# EAGLE design mimuz-can-v030 (EAGLE 7.7.0)
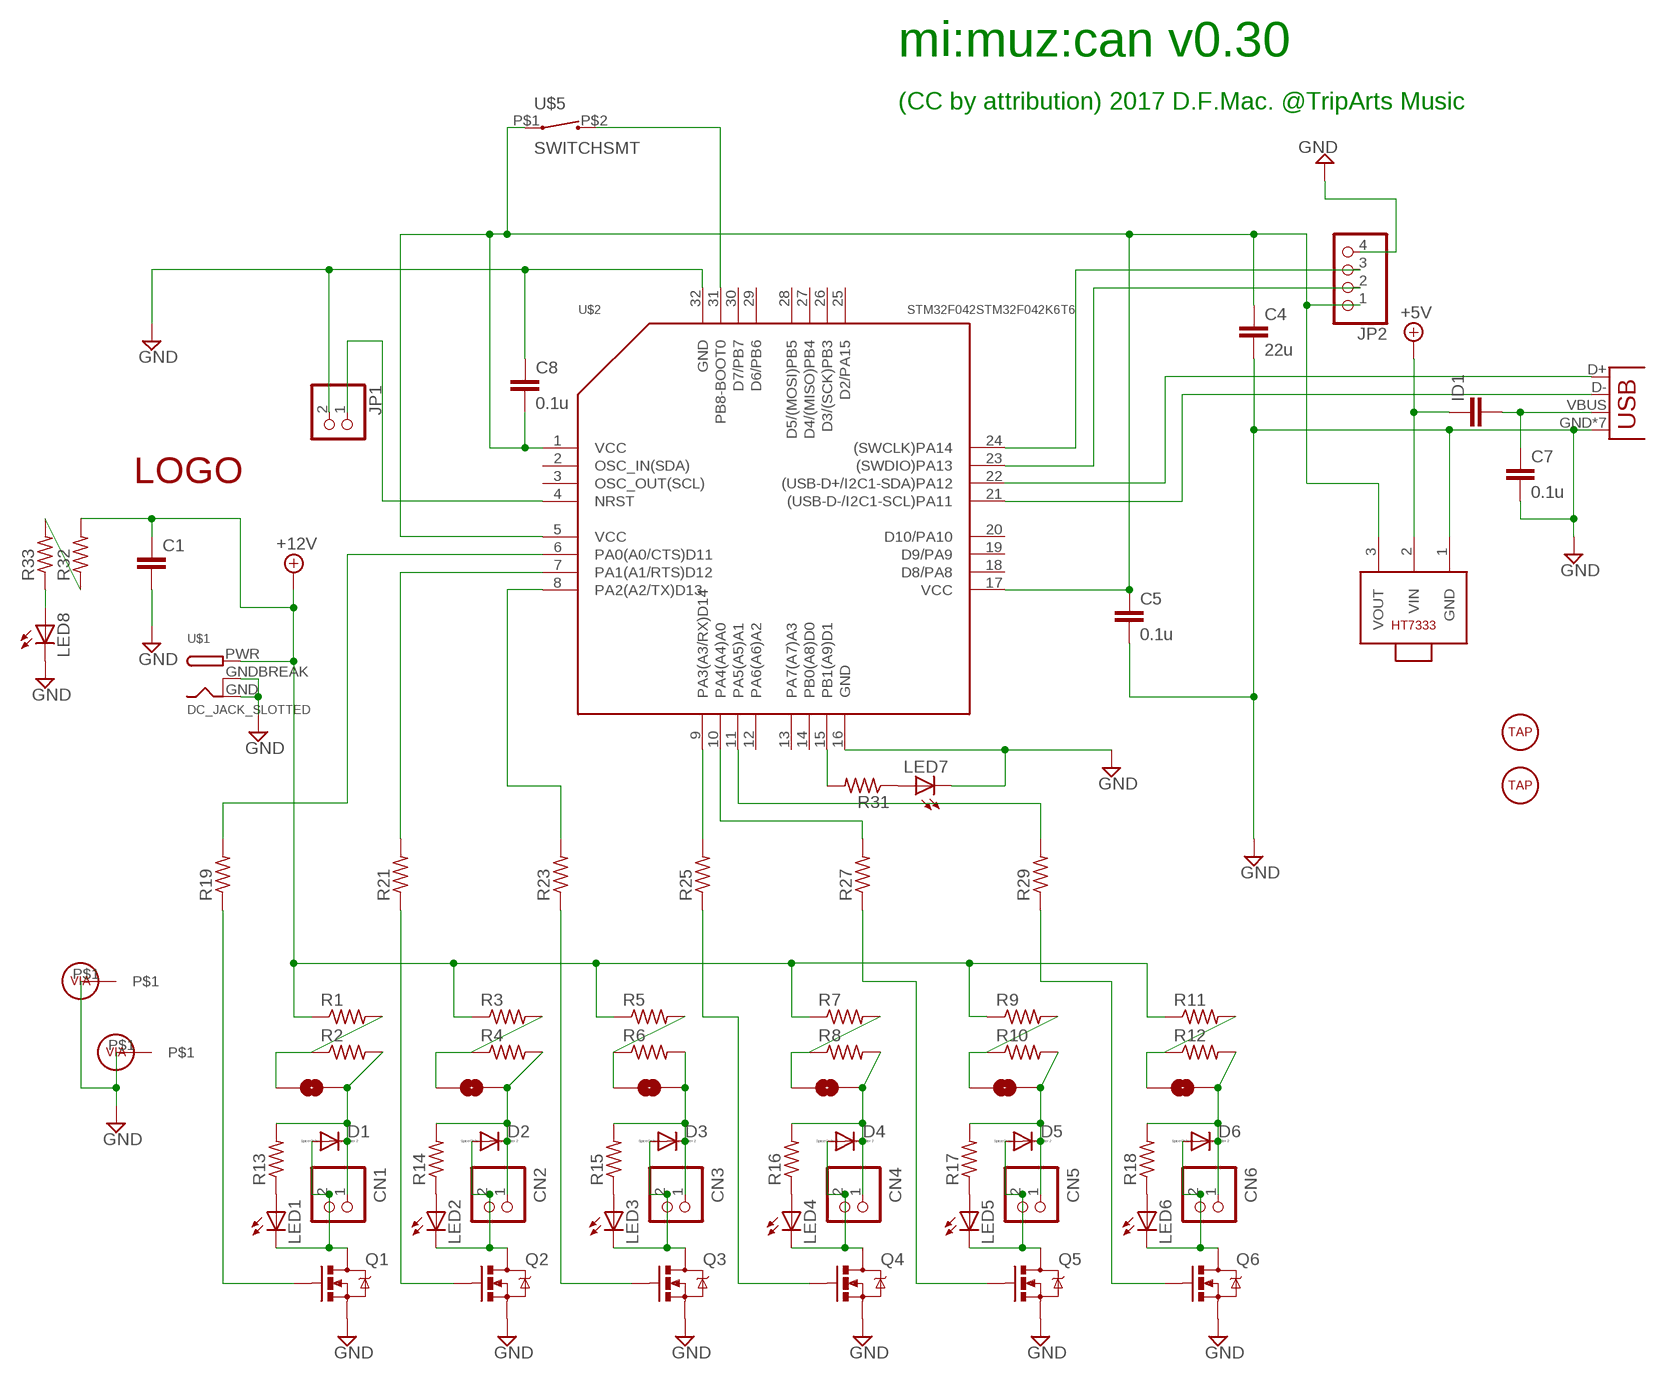
[diagram p0: schematic, sheet 1]

## Parts
C1  C-EUC1206  [C1206]
C4  22u  C-EUC0805  [C0805]
C5  0.1u  C-EUC0603  [C0603]
C7  0.1u  C-EUC0603  [C0603]
C8  0.1u  C-EUC0603  [C0603]
CN1  B2B-PH-K-S  [B2B-PH-K-S]
CN2  B2B-PH-K-S  [B2B-PH-K-S]
CN3  B2B-PH-K-S  [B2B-PH-K-S]
CN4  B2B-PH-K-S  [B2B-PH-K-S]
CN5  B2B-PH-K-S  [B2B-PH-K-S]
CN6  B2B-PH-K-S  [B2B-PH-K-S]
D1  DIODE-DO214AC  [DO214AC]
D2  DIODE-DO214AC  [DO214AC]
D3  DIODE-DO214AC  [DO214AC]
D4  DIODE-DO214AC  [DO214AC]
D5  DIODE-DO214AC  [DO214AC]
D6  DIODE-DO214AC  [DO214AC]
ID1  C-EUC0805  [C0805]
JP1  PINHD-1X2  [1X02]
JP2  PINHD-1X4  [1X04]
JP3  JUMPER-SMT_2_NO_NO-SILK  [SMT-JUMPER_2_NO_NO-SILK]
JP4  USB-MICROB  [USB-MICROB]
JP5  JUMPER-SMT_2_NO_NO-SILK  [SMT-JUMPER_2_NO_NO-SILK]
JP6  JUMPER-SMT_2_NO_NO-SILK  [SMT-JUMPER_2_NO_NO-SILK]
JP7  JUMPER-SMT_2_NO_NO-SILK  [SMT-JUMPER_2_NO_NO-SILK]
JP8  JUMPER-SMT_2_NO_NO-SILK  [SMT-JUMPER_2_NO_NO-SILK]
JP9  JUMPER-SMT_2_NO_NO-SILK  [SMT-JUMPER_2_NO_NO-SILK]
LED1  LED3MM  [LED3MM]
LED2  LED3MM  [LED3MM]
LED3  LED3MM  [LED3MM]
LED4  LED3MM  [LED3MM]
LED5  LED3MM  [LED3MM]
LED6  LED3MM  [LED3MM]
LED7  LED3MM  [LED3MM]
LED8  LED3MM  [LED3MM]
Q1  MOSFET-NCHANNELSMD  [SOT23-3]
Q2  MOSFET-NCHANNELSMD  [SOT23-3]
Q3  MOSFET-NCHANNELSMD  [SOT23-3]
Q4  MOSFET-NCHANNELSMD  [SOT23-3]
Q5  MOSFET-NCHANNELSMD  [SOT23-3]
Q6  MOSFET-NCHANNELSMD  [SOT23-3]
R1  R-US_R2512  [R2512]
R2  R-US_R2512  [R2512]
R3  R-US_R2512  [R2512]
R4  R-US_R2512  [R2512]
R5  R-US_R2512  [R2512]
R6  R-US_R2512  [R2512]
R7  R-US_R2512  [R2512]
R8  R-US_R2512  [R2512]
R9  R-US_R2512  [R2512]
R10  R-US_R2512  [R2512]
R11  R-US_R2512  [R2512]
R12  R-US_R2512  [R2512]
R13  R-US_R0805  [R0805]
R14  R-US_R0805  [R0805]
R15  R-US_R0805  [R0805]
R16  R-US_R0805  [R0805]
R17  R-US_R0805  [R0805]
R18  R-US_R0805  [R0805]
R19  R-US_R0603  [R0603]
R21  R-US_R0603  [R0603]
R23  R-US_R0603  [R0603]
R25  R-US_R0603  [R0603]
R27  R-US_R0603  [R0603]
R29  R-US_R0603  [R0603]
R31  R-US_R0603  [R0603]
R32  R-US_R0805  [R0805]
R33  R-US_R0805  [R0805]
U$1  DC_JACK_SLOTTED  [DC_JACK_SLOTTED]
U$2  STM32F042STM32F042K6T6  [TQFP32]
U$3  TAPHOLE  [TAPHOLE-3MM]
U$4  VIA  [VIA]
U$5  SWITCHSMT  [SWITCH-SMT-2*4*3]
U$6  TAPHOLE  [TAPHOLE-3MM]
U$7  VIA  [VIA]
U$12  LOGOSMALL  [LOGO-SMALL]
U$14  HT7333  [SOT89]

## Nets
3.3V: C4.1 C5.1 C8.2 JP2.1 U$2.1(VCC) U$2.5(VCC) U$2.17(VCC) U$5.P$1 U$14.3(VOUT)
+5V: ID1.1 U$14.2(VIN)
+12V: C1.1 R1.1 R3.1 R5.1 R7.1 R9.1 R11.1 R32.2 U$1.PWR
D+: JP4.D+ U$2.22((USB-D+/I2C1-SDA)PA12)
D-: JP4.D- U$2.21((USB-D-/I2C1-SCL)PA11)
GND [power]: C1.2 C4.2 C5.2 C7.2 C8.1 JP1.2 JP2.4 JP4.GND JP4.MT1(GND) JP4.MT3(GND) JP4.P$2(GND) JP4.P$4(GND) JP4.P$5(GND) JP4.P$6(GND) LED7.K(C) LED8.K(C) Q1.2(S) Q2.2(S) Q3.2(S) Q4.2(S) Q5.2(S) Q6.2(S) U$1.GND U$1.GNDBREAK U$2.16(GND) U$2.32(GND) U$4.P$1 U$7.P$1 U$14.1(GND)
N$1: JP5.1 R3.2 R4.1
N$2: JP3.1 R1.2 R2.1
N$3: JP6.1 R5.2 R6.1
N$4: CN1.1 D1.C JP3.2 R2.2 R13.2
N$5: CN2.1 D2.C JP5.2 R4.2 R14.2
N$6: CN3.1 D3.C JP6.2 R6.2 R15.2
N$7: CN1.2 D1.A LED1.K(C) Q1.3(D)
N$8: CN2.2 D2.A LED2.K(C) Q2.3(D)
N$9: CN3.2 D3.A LED3.K(C) Q3.3(D)
N$10: JP7.1 R7.2 R8.1
N$11: CN4.1 D4.C JP7.2 R8.2 R16.2
N$12: CN4.2 D4.A LED4.K(C) Q4.3(D)
N$13: CN5.2 D5.A LED5.K(C) Q5.3(D)
N$14: CN6.2 D6.A LED6.K(C) Q6.3(D)
N$15: JP8.1 R9.2 R10.1
N$16: JP9.1 R11.2 R12.1
N$17: LED1.A R13.1
N$18: CN6.1 D6.C JP9.2 R12.2 R18.2
N$19: CN5.1 D5.C JP8.2 R10.2 R17.2
N$20: LED2.A R14.1
N$21: LED3.A R15.1
N$22: LED4.A R16.1
N$23: Q2.1(G) R21.1
N$24: Q1.1(G) R19.1
N$25: LED5.A R17.1
N$26: Q3.1(G) R23.1
N$27: JP2.3 U$2.24((SWCLK)PA14)
N$28: JP2.2 U$2.23((SWDIO)PA13)
N$29: JP1.1 U$2.4(NRST)
N$30: U$2.31(PB8-BOOT0) U$5.P$2
N$31: LED6.A R18.1
N$32: R19.2 U$2.6(PA0(A0/CTS)D11)
N$33: R21.2 U$2.7(PA1(A1/RTS)D12)
N$34: R23.2 U$2.8(PA2(A2/TX)D13)
N$35: R27.2 U$2.10(PA4(A4)A0)
N$36: R25.2 U$2.9(PA3(A3/RX)D14)
N$37: Q4.1(G) R25.1
N$38: Q5.1(G) R27.1
N$39: R29.2 U$2.11(PA5(A5)A1)
N$40: Q6.1(G) R29.1
N$41: R31.2 U$2.15(PB1(A9)D1)
N$42: LED7.A R31.1
N$43: R32.1 R33.2
N$44: LED8.A R33.1
VBUS: C7.1 ID1.2 JP4.VBUS
Unconnected: U$2.2(OSC_IN(SDA)) U$2.3(OSC_OUT(SCL)) U$2.12(PA6(A6)A2) U$2.13(PA7(A7)A3) U$2.14(PB0(A8)D0) U$2.18(D8/PA8) U$2.19(D9/PA9) U$2.20(D10/PA10) U$2.25(D2/PA15) U$2.26(D3/(SCK)PB3) U$2.27(D4/(MISO)PB4) U$2.28(D5/(MOSI)PB5) U$2.29(D6/PB6) U$2.30(D7/PB7)

## Notes on the sheet
- mi:muz:can v0.30
- (CC by attribution) 2017 D.F.Mac. @TripArts Music

## Library data of the parts
C1 C4 C5 C7 C8 ID1 = 0my:C-EU: CAPACITOR, European symbol
CN1-CN6 = jst-ph:B2B-PH-*: Wire-to-Board 2.0mm pitch top mount connector Source: http://www.jst-mfg.com/product/pdf/jpn/PH.pdf http://www.jst-mfg.com/product/detail.php?series=199
D1-D6 = diode:DIODE-: DIODE
JP1 = 0my:PINHD-1X2: PIN HEADER
JP2 = 0my:PINHD-1X4: PIN HEADER
JP3 JP5-JP9 = SparkFun-Jumpers:JUMPER-SMT_2_NO: Normally open jumper This jumper has two pads in close proximity to each other. Apply solder to close the connection. Round pads are easier to solder for beginners, but are a lot larger. SparkFun Product that uses the round pads: SparkFun EL Sequencer <https://www.sparkfun.com/products/12781>
JP4 = 0my:USB: USB Connectors USB-B-PTH is fully proven SKU : PRT-00139/CONN-08278 USB-miniB is fully proven SKU : PRT-00587 USB-A-PCB is untested. USB-A-H is throughly reviewed, but untested. Spark Fun Electronics SKU : PRT-00437 USB-B-SMT is throughly reviewed, but untested. Needs silkscreen touching up. USB-A-S has not been used/tested USB-MB-H has not been used/tested USB-MICROB has been used. CONN-09505; PROD_ID: CONN-09505
LED1-LED8 = led:LED: LED OSRAM: - CHIPLED LG R971, LG N971, LY N971, LG Q971, LY Q971, LO R971, LY R971 LH N974, LH R974 LS Q976, LO Q976, LY Q976 LO Q996 - Hyper CHIPLED LW Q18S LB Q993, LB Q99A, LB R99A - SideLED LS A670, LO A670, LY A670, LG A670, LP A670 LB A673, LV A673, LT A673, LW A673 LH A674 LY A675 LS A676, LA A676, LO A676, LY A676, LW A676 LS A679, LY A679, LG A679 - Hyper Micro SIDELED® LS Y876, LA Y876, LO Y876, LY Y876 LT Y87S - SmartLED LW L88C, LW L88S LB L89C, LB L89S, LG L890 LS L89K, LO L89K, LY L89K LS L896, LA L896, LO L896, LY L896 - TOPLED LS T670, LO T670, LY T670, LG T670, LP T670 LSG T670, LSP T670, LSY T670, LOP T670, LYG T670 LG T671, LOG T671, LSG T671 LB T673, LV T673, LT T673, LW T673 LH T674 LS T676, LA T676, LO T676, LY T676, LB T676, LH T676, LSB T676, LW T676 LB T67C, LV T67C, LT T67C, LS T67K, LO T67K, LY T67K, LW E67C LS E67B, LA E67B, LO E67B, LY E67B, LB E67C, LV E67C, LT E67C LW T67C LS T679, LY T679, LG T679 LS T770, LO T770, LY T770, LG T770, LP T770 LB T773, LV T773, LT T773, LW T773 LH T774 LS E675, LA E675, LY E675, LS T675 LS T776, LA T776, LO T776, LY T776, LB T776 LHGB T686 LT T68C, LB T68C - Hyper Mini TOPLED® LB M676 - Mini TOPLED Santana® LG M470 LS M47K, LO M47K, LY M47K Source: http://www.osram.convergy.de LUXEON: - LUMILED® LXK2-PW12-R00, LXK2-PW12-S00, LXK2-PW14-U00, LXK2-PW14-V00 LXK2-PM12-R00, LXK2-PM12-S00, LXK2-PM14-U00 LXK2-PE12-Q00, LXK2-PE12-R00, LXK2-PE12-S00, LXK2-PE14-T00, LXK2-PE14-U00 LXK2-PB12-K00, LXK2-PB12-L00, LXK2-PB12-M00, LXK2-PB14-N00, LXK2-PB14-P00, LXK2-PB14-Q00 LXK2-PR12-L00, LXK2-PR12-M00, LXK2-PR14-Q00, LXK2-PR14-R00 LXK2-PD12-Q00, LXK2-PD12-R00, LXK2-PD12-S00 LXK2-PH12-R00, LXK2-PH12-S00 LXK2-PL12-P00, LXK2-PL12-Q00, LXK2-PL12-R00 Source: www.luxeon.com KINGBRIGHT: KA-3528ASYC Source: www.kingbright.com
Q1-Q6 = 0my:MOSFET-NCHANNEL: Generic NMOS footprint
R1-R19 R21 R23 R25 R27 R29 R31-R33 = 0my:R-US_: RESISTOR, American symbol
U$1 = dcjack_slotted:DC_JACK_SLOTTED
U$2 = 1my:STM32F042
U$3 U$6 = 0my:TAPHOLE
U$4 U$7 = 0my:VIA
U$5 = 1my:SWITCH
U$12 = 0my:LOGO
U$14 = 0my:HT7333

## Net classes
0 default: width 0.406 mm, clearance 0.254 mm
1 power: width 0.533 mm, clearance 0.254 mm
2 D+: width 0.305 mm, clearance 0.203 mm
3 D-: width 0.305 mm, clearance 0.203 mm
4 VBUS: width 0.406 mm, clearance 0.203 mm

## Board
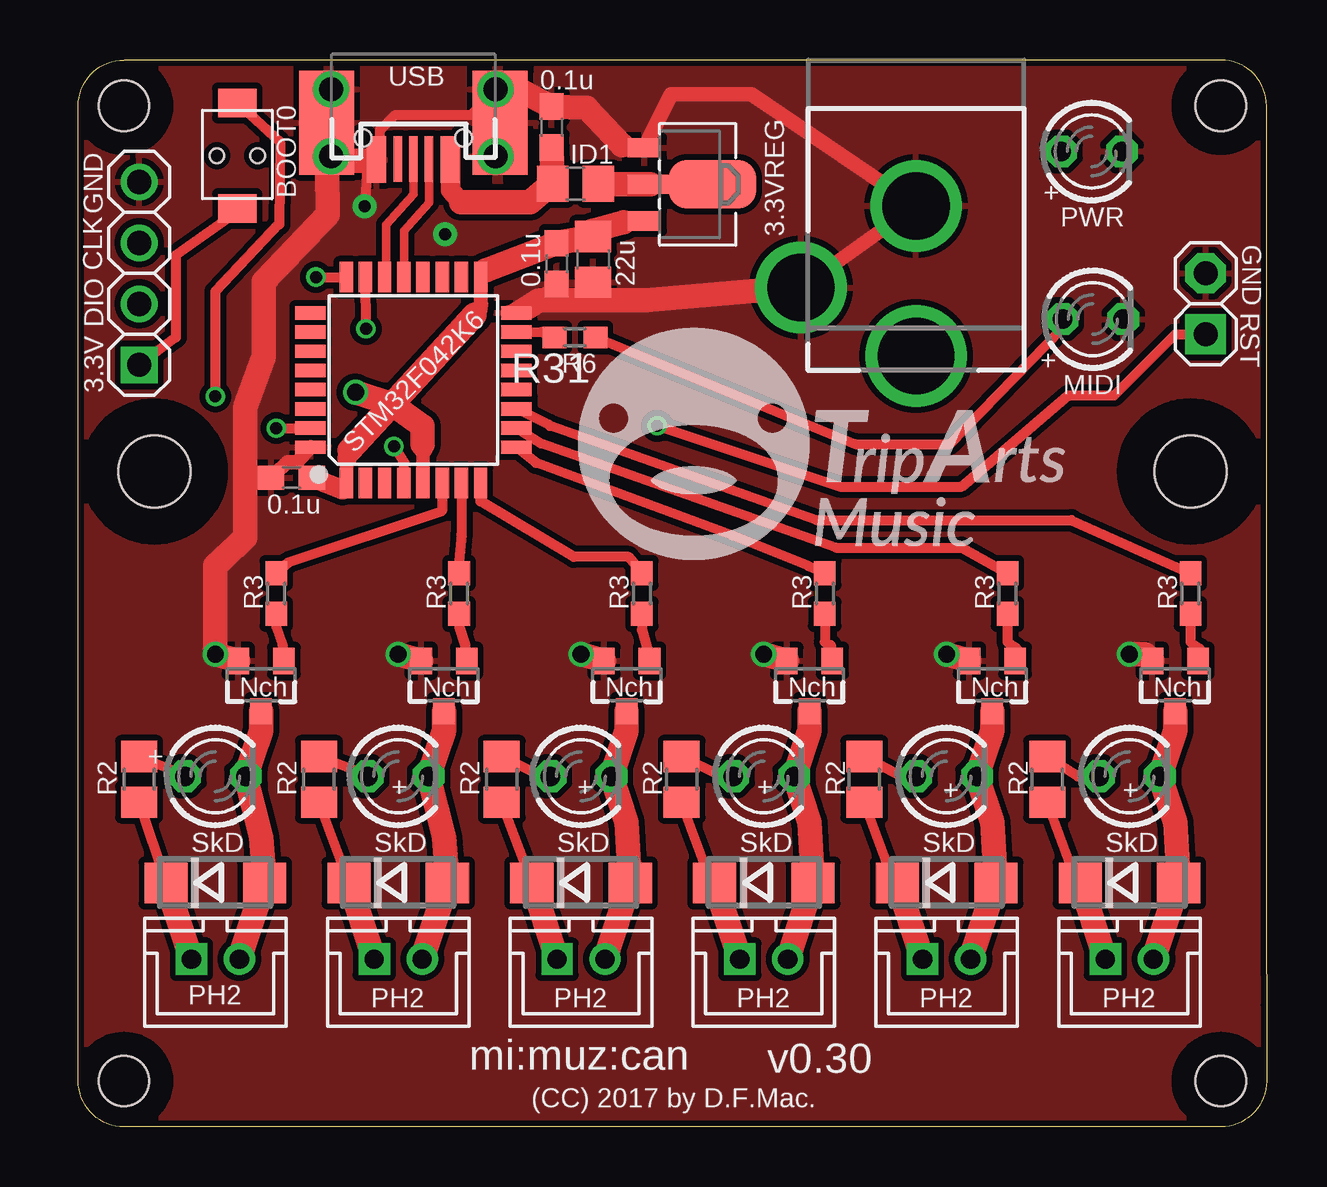
[diagram p1: board, top side]
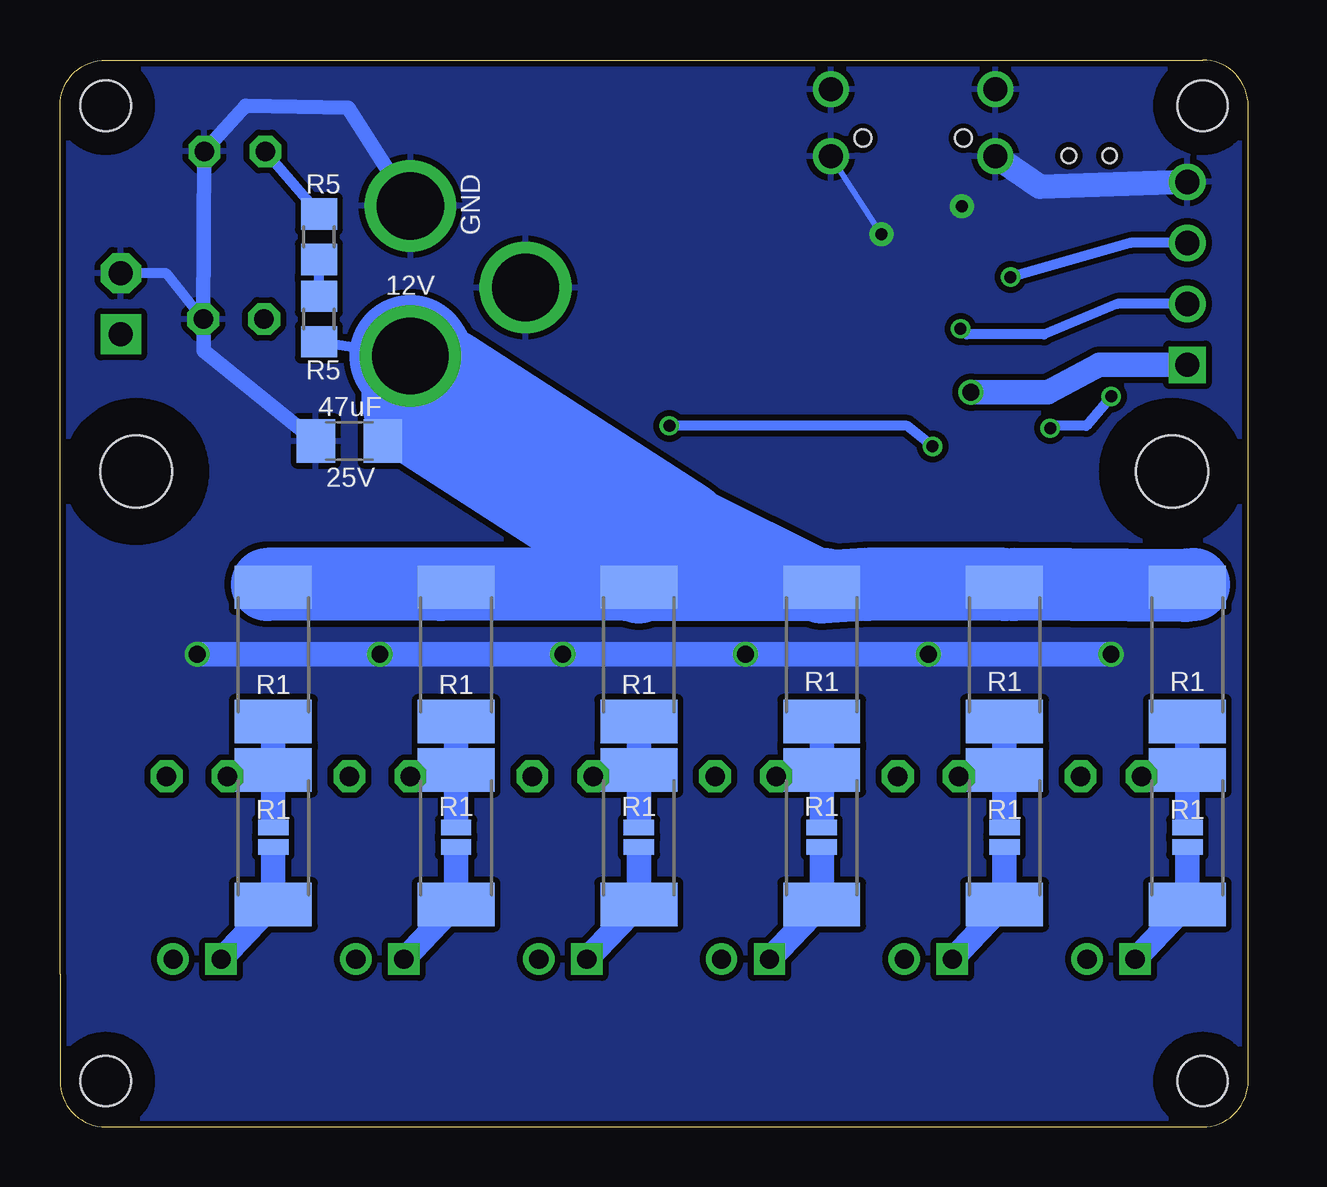
[diagram p2: board, bottom side, seen from below]

Size 49.53 x 44.45 mm. Coordinates in mm from the lower left corner, seen from the top.
Outline: 47.62,0 1.91,0 arc-90 0,1.91 0,42.55 arc-90 1.91,44.45 47.62,44.45 arc-90 49.53,42.55 49.53,6.35 49.53,5.08 49.53,1.91 arc-90 47.62,0
Copper layers (1*16): Top 0.035mm / dielectric 1.5mm / Bottom 0.035mm
Design rules "Elecrow_2-layer_eagle_rule": minimum track width 6mil, minimum drill 12mil, track to track 6mil, track to pad 6mil, pad to pad 6mil, via to via 6mil, smd to smd 0mil, copper to edge 10mil, drill to drill 10mil, minimum pad ring 10mil, minimum via ring 6mil, stop-mask expansion 2mil, vias tented up to drill 100mil, thermal gap 10mil
Holes 2.1 mm at 1.91,1.91 47.62,1.91 1.91,42.55 47.62,42.55
tRestrict: area 0,40.6 to 3.8,44.5; area 45.7,40.6 to 49.5,44.5; area 45.7,0 to 49.5,3.8; area 0,0 to 3.8,3.8
bRestrict: area 0,40.6 to 3.8,44.5; area 45.7,40.6 to 49.5,44.5; area 45.7,0 to 49.5,3.8; area 0,0 to 3.8,3.8

### Footprints (pad centres in the part's own frame; a part is rotated, then mirrored left to right if it is on the bottom)
C1206 = smd 1.6 x 1.8: 1 -1.4,0; 2 1.4,0
C0805 = smd 1.3 x 1.5: 1 -0.95,0; 2 0.95,0
C0603 = smd 1.1 x 1: 1 -0.85,0; 2 0.85,0
B2B-PH-K-S = drill 0.8 square: 1 -1,0 | drill 0.8: 2 1,0
DO214AC = smd 1.8 x 1.7: A 2.05,0; C -2.05,0
1X02 = drill 1 pad 1.676 square: 1 -1.27,0 | drill 1 pad 1.676 octagon: 2 1.27,0
1X04 = drill 1.016 square: 1 -3.81,0 | drill 1.016: 2 -1.27,0; 3 1.27,0; 4 3.81,0
SMT-JUMPER_2_NO_NO-SILK = smd 0.635 x 1.27: 1 -0.406,0; 2 0.406,0
USB-MICROB = smd 0.35 x 1.9: D+ 0,2.904; D- -0.65,2.904; ID 0.65,2.904 | smd 0.813 x 1.93: GND 1.541,2.929; VBUS -1.541,2.929 | smd 2.286 x 4.318: MT1 3.62,1.397; MT3 -3.619,1.397 | drill 1: P$2 -3.429,2.794; P$4 -3.429,0; P$5 3.429,2.794; P$6 3.429,0 | hole 0.7: -2.095,2.032; 2.095,2.032
LED3MM = drill 0.813 octagon: A -1.27,0; K 1.27,0
SOT23-3 = smd 0.9 x 1.1: 1 -0.95,-1; 2 0.95,-1; 3 0,1.1
R2512 = smd 1.8 x 3.2: 1 -2.8,0; 2 2.8,0
R0805 = smd 1.3 x 1.5: 1 -0.95,0; 2 0.95,0
R0603 = smd 1 x 0.9: 1 -0.85,0; 2 0.85,0
DC_JACK_SLOTTED = drill 2.8: GND 3.81,6.08; GNDBREAK 8.61,9.48 | drill 3.2: PWR 3.81,12.33
TQFP32 = smd 1.27 x 0.559: 1 -4.293,2.8; 2 -4.293,2; 3 -4.293,1.2; 4 -4.293,0.4; 5 -4.293,-0.4; 6 -4.293,-1.2; 7 -4.293,-2; 8 -4.293,-2.8; 17 4.293,-2.8; 18 4.293,-2; 19 4.293,-1.2; 20 4.293,-0.4; 21 4.293,0.4; 22 4.293,1.2; 23 4.293,2; 24 4.293,2.8 | smd 0.559 x 1.27: 9 -2.8,-4.293; 10 -2,-4.293; 11 -1.2,-4.293; 12 -0.4,-4.293; 13 0.4,-4.293; 14 1.2,-4.293; 15 2,-4.293; 16 2.8,-4.293; 25 2.8,4.293; 26 2,4.293; 27 1.2,4.293; 28 0.4,4.293; 29 -0.4,4.293; 30 -1.2,4.293; 31 -2,4.293; 32 -2.8,4.293
TAPHOLE-3MM = hole 3: 0,0
VIA = drill 0.5 pad 0.813: P$1 0,0
SWITCH-SMT-2*4*3 = smd 1.2 x 1.6: P$1 2.2,0; P$2 -2.2,0 | hole 0.6: 0,-0.85; 0,0.85
SOT89 = smd 0.8 x 1.4: 1 -1.524,-1.905; 3 1.524,-1.905 | smd 0.8 x 1.9: 2 0,-1.651 | smd 2.032 x 3.65: 4 0,0.94

### Placement (x,y rotation side)
C1  37.47,28.57 180 bottom
C4  21.46,36.14 270 top
C5  19.94,35.97 270 top
C7  19.74,41.66 90 top
C8  8.89,27.05 0 top
CN1  5.71,6.99 0 top
CN2  13.34,6.99 0 top
CN3  20.95,6.99 0 top
CN4  28.57,6.99 0 top
CN5  36.2,6.99 0 top
CN6  43.81,6.99 0 top
D1  5.71,10.16 0 top
D2  13.34,10.16 0 top
D3  20.95,10.16 0 top
D4  28.57,10.16 0 top
D5  36.2,10.16 0 top
D6  43.81,10.16 0 top
ID1  20.73,39.29 180 top
JP1  46.99,34.29 90 top
JP2  2.54,35.56 90 top
JP3  2.54,12.06 270 bottom
JP4  13.97,43.23 180 top
JP5  10.16,12.06 270 bottom
JP6  17.78,12.06 270 bottom
JP7  25.4,12.06 270 bottom
JP8  33.02,12.06 270 bottom
JP9  40.64,12.06 270 bottom
LED1  5.71,14.61 0 top
LED2  13.34,14.61 0 top
LED3  20.95,14.61 0 top
LED4  28.57,14.61 0 top
LED5  36.2,14.61 0 top
LED6  43.81,14.61 0 top
LED7  42.29,33.66 0 top
LED8  42.24,40.64 0 top
Q1  7.62,18.41 180 top
Q2  15.24,18.41 180 top
Q3  22.86,18.41 180 top
Q4  30.48,18.41 180 top
Q5  38.1,18.41 180 top
Q6  45.72,18.41 180 top
R1  2.54,19.68 270 bottom
R2  2.54,12.06 270 bottom
R3  10.16,19.68 270 bottom
R4  10.16,12.06 270 bottom
R5  17.78,19.68 270 bottom
R6  17.78,12.06 270 bottom
R7  25.4,19.68 270 bottom
R8  25.4,12.06 270 bottom
R9  33.02,19.68 270 bottom
R10  33.02,12.06 270 bottom
R11  40.64,19.68 270 bottom
R12  40.64,12.06 270 bottom
R13  2.54,14.48 270 top
R14  10.03,14.48 270 top
R15  17.65,14.48 270 top
R16  25.15,14.48 270 top
R17  32.77,14.48 270 top
R18  40.39,14.48 270 top
R19  8.26,22.23 90 top
R21  15.88,22.23 90 top
R23  23.5,22.23 90 top
R25  31.11,22.23 90 top
R27  38.73,22.23 90 top
R29  46.35,22.23 90 top
R31  20.7,32.89 180 top
R32  38.73,33.66 270 bottom
R33  38.73,37.08 270 bottom
U$1  38.73,44.45 180 top
U$2  13.97,31.11 90 top
U$3  3.17,27.3 0 top
U$4  11.94,38.35 0 top
U$5  6.63,40.46 270 top
U$6  46.35,27.3 0 top
U$7  15.29,37.19 0 top
U$12  20.83,23.62 0 top
U$14  25.5,39.27 270 top

### Tracks (layer width: path | path; a pad name or v marks a point on that pad's centre or on a via)
3.3V  (via drill 0.7)
  Top 0.406: 11.02,26.54 U$2.1 11.18,27.58 | 16.79,35.76 U$2.17 | U$2.17 16.79,34.27 | U$2.5 14.38,27.23 | U$5.P$1 6.6,38.1 4.06,36.32 4.06,32.89 JP2.1 | 19.96,36.83 C5.1 | 16.99,35.69 U$2.17
  Top 0.559: 14.38,27.23 14.38,28.25
  Top 0.584: 16.79,34.27 16.79,35.76
  Top 0.61: 16.79,34.27 16.71,33.81 16.51,33.83 | 11.2,27.86 11.18,27.58
  Top 0.813: 11.02,26.54 C8.2 | 11.3,28.19 11.2,27.86 | 14.38,28.25 14.35,28.45 | U$14.3 22.73,37.69
  Top 1.016: 16.51,33.83 13.08,30.1 | 13.08,30.1 11.3,28.19 | 14.35,28.45 14.35,29.18 13.08,30.1 | v11.56,30.61 13.08,30.1 | 22.73,37.69 21.44,37.34 C4.1 19.96,36.83 | C5.1 16.99,35.69
  Bottom 1.016: JP2.1 6.2,31.75 8.36,30.61 v11.56,30.61
+5V
  Top 0.406: ID1.1 21.79,39.27
  Top 1.016: 22.12,39.29 21.79,39.27 U$14.2
+12V
  Bottom 0.406: R32.2 U$1.PWR | R1.1 2.67,22.48 2.64,22.55
  Bottom 1.016: 9.78,22.61 10.16,22.61 R3.1 | R9.1 33.66,22.61 | 40.89,22.61 R11.1 | C1.1 U$1.PWR
  Bottom 3.048: 24.26,24.13 23.37,25.27 R5.1 | 2.29,22.61 2.64,22.55 9.78,22.61 | 10.16,22.61 15.88,22.61 R5.1 | 25.91,22.61 17.65,22.61 R5.1 | R7.1 25.91,22.61 | 25.91,22.61 33.66,22.61 40.89,22.61
  Bottom 5.08: U$1.PWR 33.91,30.35
  Bottom 6.096: 33.91,30.35 24.26,24.13
D+
  Top 0.356: 12.83,35.05 12.83,37.59 13.97,38.86 JP4.D+
  Top 0.406: U$2.22 12.83,35.05
D-
  Top 0.356: 13.59,35.18 13.59,37.34 14.63,38.51 JP4.D-
  Top 0.406: U$2.21 13.59,35.18
GND  (via drill 0.7)
  Top 0.406: JP4.P$5 JP4.P$6 | JP4.P$5 10.54,43.31 | JP4.P$5 10.54,40.26 | JP4.P$4 16.38,42.16 13.21,42.16 12.57,41.53 12.57,41.02 12.45,40.77 JP4.GND 12.06,40.26 U$4.P$1 | 18.26,33.93 U$2.16
  Top 0.61: U$2.32 9.12,27.69 8.74,27.69 8,27.05 C8.1 | 22.66,40.89 U$14.1 24.71,43.03 28.07,43.03 U$1.GND U$1.GNDBREAK | 18.03,33.93 19.13,34.62 19.25,34.44 C5.2 | 18.03,33.93 18.01,33.93 | 18.01,33.93 17.96,33.93 | 18.01,33.93 18.9,34.01 19.71,34.54 18.77,33.93 18.26,33.93 18.03,33.93 | C4.2 21.34,34.52 21.44,34.49 21.44,34.44
  Top 1.016: 10.54,40.26 12.06,40.26 | 19.25,34.44 21.44,34.44 23.67,34.44 29.21,34.92 U$1.GNDBREAK | JP4.MT1 10.39,38 7.72,35.2 7.72,32.08 6.96,29.97 6.96,27.05 | 6.96,27.05 C8.1 | JP4.P$2 JP4.P$4 | JP4.MT3 JP4.P$4 | JP4.P$4 18.54,43.13 C7.2 21.18,42.47 22.66,40.89 | Q6.2 44.45,19.68 v43.81,19.68 | Q1.2 v5.71,19.68 5.71,23.37 6.96,24.54 6.96,27.05 | Q2.2 v13.34,19.68 | Q3.2 v20.95,19.68 | Q4.2 v28.57,19.68 | Q5.2 v36.2,19.68
  Bottom 0.254: U$7.P$1 JP4.P$2
  Bottom 0.406: LED7.K 45.09,35.56 JP1.2
  Bottom 0.61: C1.2 43.54,32.33 LED7.K LED8.K 41.78,42.55 37.52,42.47 U$1.GND
  Bottom 1.016: JP2.4 8.69,39.17 JP4.P$5 | v43.81,19.68 v36.2,19.68 v28.57,19.68 v20.95,19.68 v13.34,19.68 v5.71,19.68
  pour Top: 0,45.09 49.53,45.09 49.53,-0.64 0,-0.64
  pour Bottom: -0.64,44.45 49.53,44.45 49.53,0 -0.64,0
N$1
  Bottom 0.406: JP5.1 10.16,12.83
  Bottom 1.016: R3.2 R4.1 10.16,12.83
N$2
  Bottom 0.406: JP3.1 2.54,12.83
  Bottom 1.016: R1.2 R2.1 2.54,12.83
N$3
  Bottom 0.406: JP6.1 17.78,12.83
  Bottom 1.016: R5.2 R6.1 17.78,12.83
N$4
  Top 0.406: 4.45,6.99 CN1.1 | D1.C R13.2
  Top 1.016: D1.C CN1.1
  Bottom 0.406: JP3.2 2.54,11.3
  Bottom 1.016: CN1.1 R2.2 2.54,11.3
N$5
  Top 0.406: D2.C R14.2
  Top 1.016: D2.C CN2.1
  Bottom 0.406: JP5.2 10.16,11.3
  Bottom 1.016: CN2.1 R4.2 10.16,11.3
N$6
  Top 0.406: D3.C R15.2
  Top 1.016: D3.C CN3.1
  Bottom 0.406: JP6.2 17.78,11.3
  Bottom 1.016: CN3.1 R6.2 17.78,11.3
N$7
  Top 1.016: Q1.3 7.62,16.51 LED1.K 7.62,12.06 D1.A CN1.2
N$8
  Top 1.016: Q2.3 15.24,16.51 LED2.K 15.24,12.06 D2.A CN2.2
N$9
  Top 1.016: Q3.3 22.86,16.51 LED3.K 22.86,12.7 D3.A CN3.2
N$10
  Bottom 0.406: JP7.1 25.4,12.83
  Bottom 1.016: R7.2 R8.1 25.4,12.83
N$11
  Top 0.406: CN4.1 R16.2
  Top 1.016: D4.C CN4.1
  Bottom 0.406: JP7.2 25.4,11.3
  Bottom 1.016: CN4.1 R8.2 25.4,11.3
N$12
  Top 1.016: CN4.2 D4.A 30.48,12.7 LED4.K 30.48,16.51 Q4.3
N$13
  Top 1.016: CN5.2 D5.A 38.1,12.7 LED5.K 38.1,16.51 Q5.3
N$14
  Top 1.016: CN6.2 D6.A 45.72,12.7 LED6.K 45.72,16.51 Q6.3
N$15
  Bottom 0.406: JP8.1 33.02,12.83
  Bottom 1.016: R9.2 R10.1 33.02,12.83
N$16
  Bottom 0.406: JP9.1 40.64,12.83
  Bottom 1.016: R11.2 R12.1 40.64,12.83
N$17
  Top 0.406: R13.1 4.57,14.61 LED1.A
N$18
  Top 0.406: CN6.1 R18.2
  Top 1.016: D6.C CN6.1
  Bottom 0.406: JP9.2 40.64,11.3
  Bottom 1.016: CN6.1 R12.2 40.64,11.3
N$19
  Top 0.406: CN5.1 R17.2
  Top 1.016: D5.C CN5.1
  Bottom 0.406: JP8.2 33.02,11.3
  Bottom 1.016: CN5.1 R10.2 33.02,11.3
N$20
  Top 0.406: LED2.A 12.19,14.61 R14.1
N$21
  Top 0.406: LED3.A 19.3,14.61 R15.1
N$22
  Top 0.406: LED4.A 26.8,14.61 R16.1
N$23
  Top 0.406: R21.1 15.88,20.83 16.13,20.07 Q2.1
N$24
  Top 0.406: R19.1 8.26,20.83 8.51,20.07 Q1.1
N$25
  Top 0.406: LED5.A 34.29,14.61 R17.1
N$26
  Top 0.406: R23.1 23.5,20.7 23.75,19.81 Q3.1
N$27  (via drill 0.5)
  Top 0.406: v9.91,35.41 U$2.24
  Bottom 0.406: JP2.3 4.9,36.83 v9.91,35.41
N$28  (via drill 0.5)
  Top 0.406: v11.99,33.25 U$2.23
  Bottom 0.406: JP2.2 5.46,34.29 8.51,33.02 11.73,33.02 v11.99,33.25
N$29  (via drill 0.5)
  Top 0.406: U$2.4 13.56,26.87 13.56,26.75 13.59,27.69 v13.16,28.35 | v24.13,29.21 31.75,26.67 36.83,26.67 41.27,30.48 43.18,30.48 45.72,33.02 JP1.1
  Bottom 0.406: v13.16,28.35 14.22,29.21 v24.13,29.21
N$30  (via drill 0.5)
  Top 0.406: U$5.P$2 8.41,41.02 8.38,37.59 8.38,37.62 5.71,34.8 v5.71,30.43 | v8.26,29.11 U$2.31
  Bottom 0.406: v5.71,30.43 6.76,29.21 8,29.21 v8.26,29.11 8.13,29.21
N$31
  Top 0.406: LED6.A 41.66,14.61 R18.1
N$32
  Top 0.406: U$2.6 15.16,25.65 8.76,23.52 R19.2
N$33
  Top 0.406: U$2.7 15.98,24.69 15.88,23.57 R21.2
N$34
  Top 0.406: U$2.8 16.76,26.06 20.65,23.75 22.94,23.75 R23.2
N$35
  Top 0.406: U$2.10 19.28,28.47 31.57,24.13 36.83,24.13 R27.2
N$36
  Top 0.406: U$2.9 19.07,27.66 27.25,24.64 30.43,23.37 R25.2
N$37
  Top 0.406: R25.1 31.11,20.19 31.37,20.07 Q4.1
N$38
  Top 0.406: R27.1 38.73,20.19 39.12,19.94 Q5.1
N$39
  Top 0.406: U$2.11 19.61,29.26 19.66,29.21 30.76,25.27 41.4,25.27 R29.2
N$40
  Top 0.406: R29.1 46.35,20.19 46.74,19.94 Q6.1
N$41
  Top 0.406: U$2.15 19.28,33.12 19.71,33.02 R31.2
N$42
  Top 0.406: R31.1 32.38,28.45 36.32,28.45 41.02,33.27 LED7.A
N$43
  Bottom 0.406: R32.1 R33.2
N$44
  Bottom 0.406: R33.1 LED8.A
VBUS
  Top 0.813: 15.95,38.53 15.52,39.01 JP4.VBUS
  Top 1.016: 15.95,38.53 18.82,38.53 19.74,39.29 ID1.2 C7.1

### Text on the board
_tNames: USB | 0.1u | BOOT0 | ID1 | 3.3VREG | GND | + | PWR | CLK | 0.1u | 22u | GND | DIO | RST | 3.3V | R6 | + | STM32F042K6 | MIDI | 0.1u | R3 | R3 | R3 | R3 | R3 | R3 | Nch | Nch | Nch | Nch | Nch | Nch | R2 | + | R2 | R2 | R2 | R2 | R2 | + | + | + | + | + | SkD | SkD | SkD | SkD | SkD | SkD | PH2 | PH2 | PH2 | PH2 | PH2 | PH2 | mi:muz:can | v0.30 | (CC) 2017 by D.F.Mac.
_bNames: R5 | GND | 12V | R5 | 47uF | 25V | R1 | R1 | R1 | R1 | R1 | R1 | R1 | R1 | R1 | R1 | R1 | R1